# Altium schematic sheet HC01.SchDoc
size A4
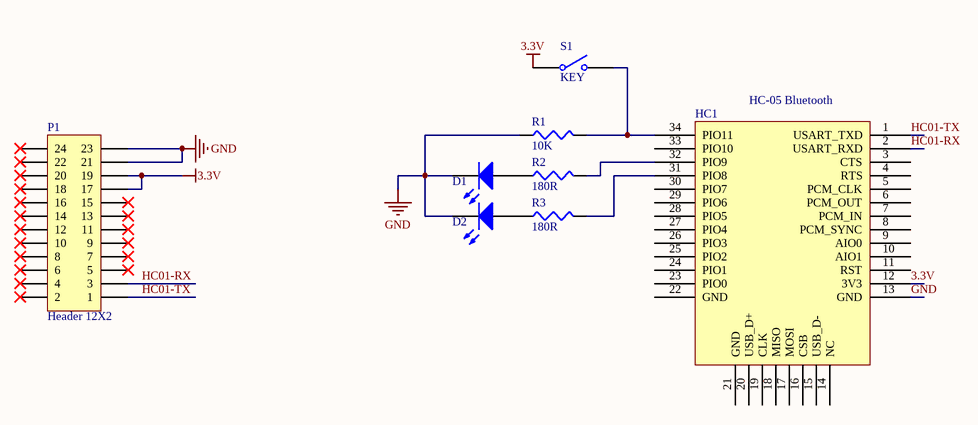
[diagram p0: HC01.SchDoc]

## Parts
D1  LED2  [3.2X1.6X1.1]  (value not drawn)
D2  LED2  [3.2X1.6X1.1]  (value not drawn)
HC1  HC-05 Bluetooth  [HC-05]
P1  Header 12X2  [HDR2X12]
R1  10K  [1206]
R2  180R  [1206]
R3  180R  [1206]
S1  KEY  [SW-SMD]

## Nets
3.3V: HC1.12(3V3) P1.17 P1.19 S1.1(COMMON)
GND: D1.2(K) D2.2(K) HC1.13(GND) P1.21 P1.23 R1.1
HC01-RX: HC1.2(USART_RXD) P1.3
HC01-TX: HC1.1(USART_TXD) P1.1
NetD1_1: D1.1(A) R2.1
NetD2_1: D2.1(A) R3.1
NetHC1_31: HC1.31(PIO8) R3.2
NetHC1_32: HC1.32(PIO9) R2.2
NetHC1_34: HC1.34(PIO11) R1.2 S1.2(NO)

Not connected (* = marked no-connect by the designer): HC1 3(CTS) 4(RTS) 5(PCM_CLK) 6(PCM_OUT) 7(PCM_IN) 8(PCM_SYNC) 9(AIO0) 10(AIO1) 11(RST) 14(NC) 15(USB_D-) 16(CSB) 17(MOSI) 18(MISO) 19(CLK) 20(USB_D+) 21(GND) 22(GND) 23(PIO0) 24(PIO1) 25(PIO2) 26(PIO3) 27(PIO4) 28(PIO5) 29(PIO6) 30(PIO7) 33(PIO10); P1 2* 4* 5* 6* 7* 8* 9* 10* 11* 12* 13* 14* 15* 16* 18* 20* 22* 24*

## Library data of the parts
D1 D2 = LED2: Typical RED, GREEN, YELLOW, AMBER GaAs LED; Published: 8-Jun-2000; LatestRevisionDate: 17-Jul-2002; LatestRevisionNote: Re-released for DXP Platform.; PackageVersion: Feb-2002; PackageReference: 3.2X1.6X1.1; Publisher: Altium Limited; PackageDescription: SM LED; 2 Flat Leads
P1 = Header 12X2: Header, 12-Pin, Dual row; LatestRevisionDate: 17-Jul-2002; LatestRevisionNote: Re-released for DXP Platform.; Publisher: Altium Limited
R1-R3 = Res3: Resistor; Value: 1K; Published: 8-Jun-2000; LatestRevisionDate: 29-May-2009; LatestRevisionNote: IPC-7351 Footprint Added.; PackageReference: J1-0603; Publisher: Altium Limited; PackageDescription: Chip Resistor
S1 = SW-SPST: Single-Pole, Single-Throw Switch; Published: 24-Mar-1999; LatestRevisionDate: 17-Jul-2002; LatestRevisionNote: Re-released for DXP Platform.; PackageReference: SPST-2; Publisher: Altium Limited; PackageDescription: Switch; 2 Leads